# EAGLE design Test1 (EAGLE 7.6.0)
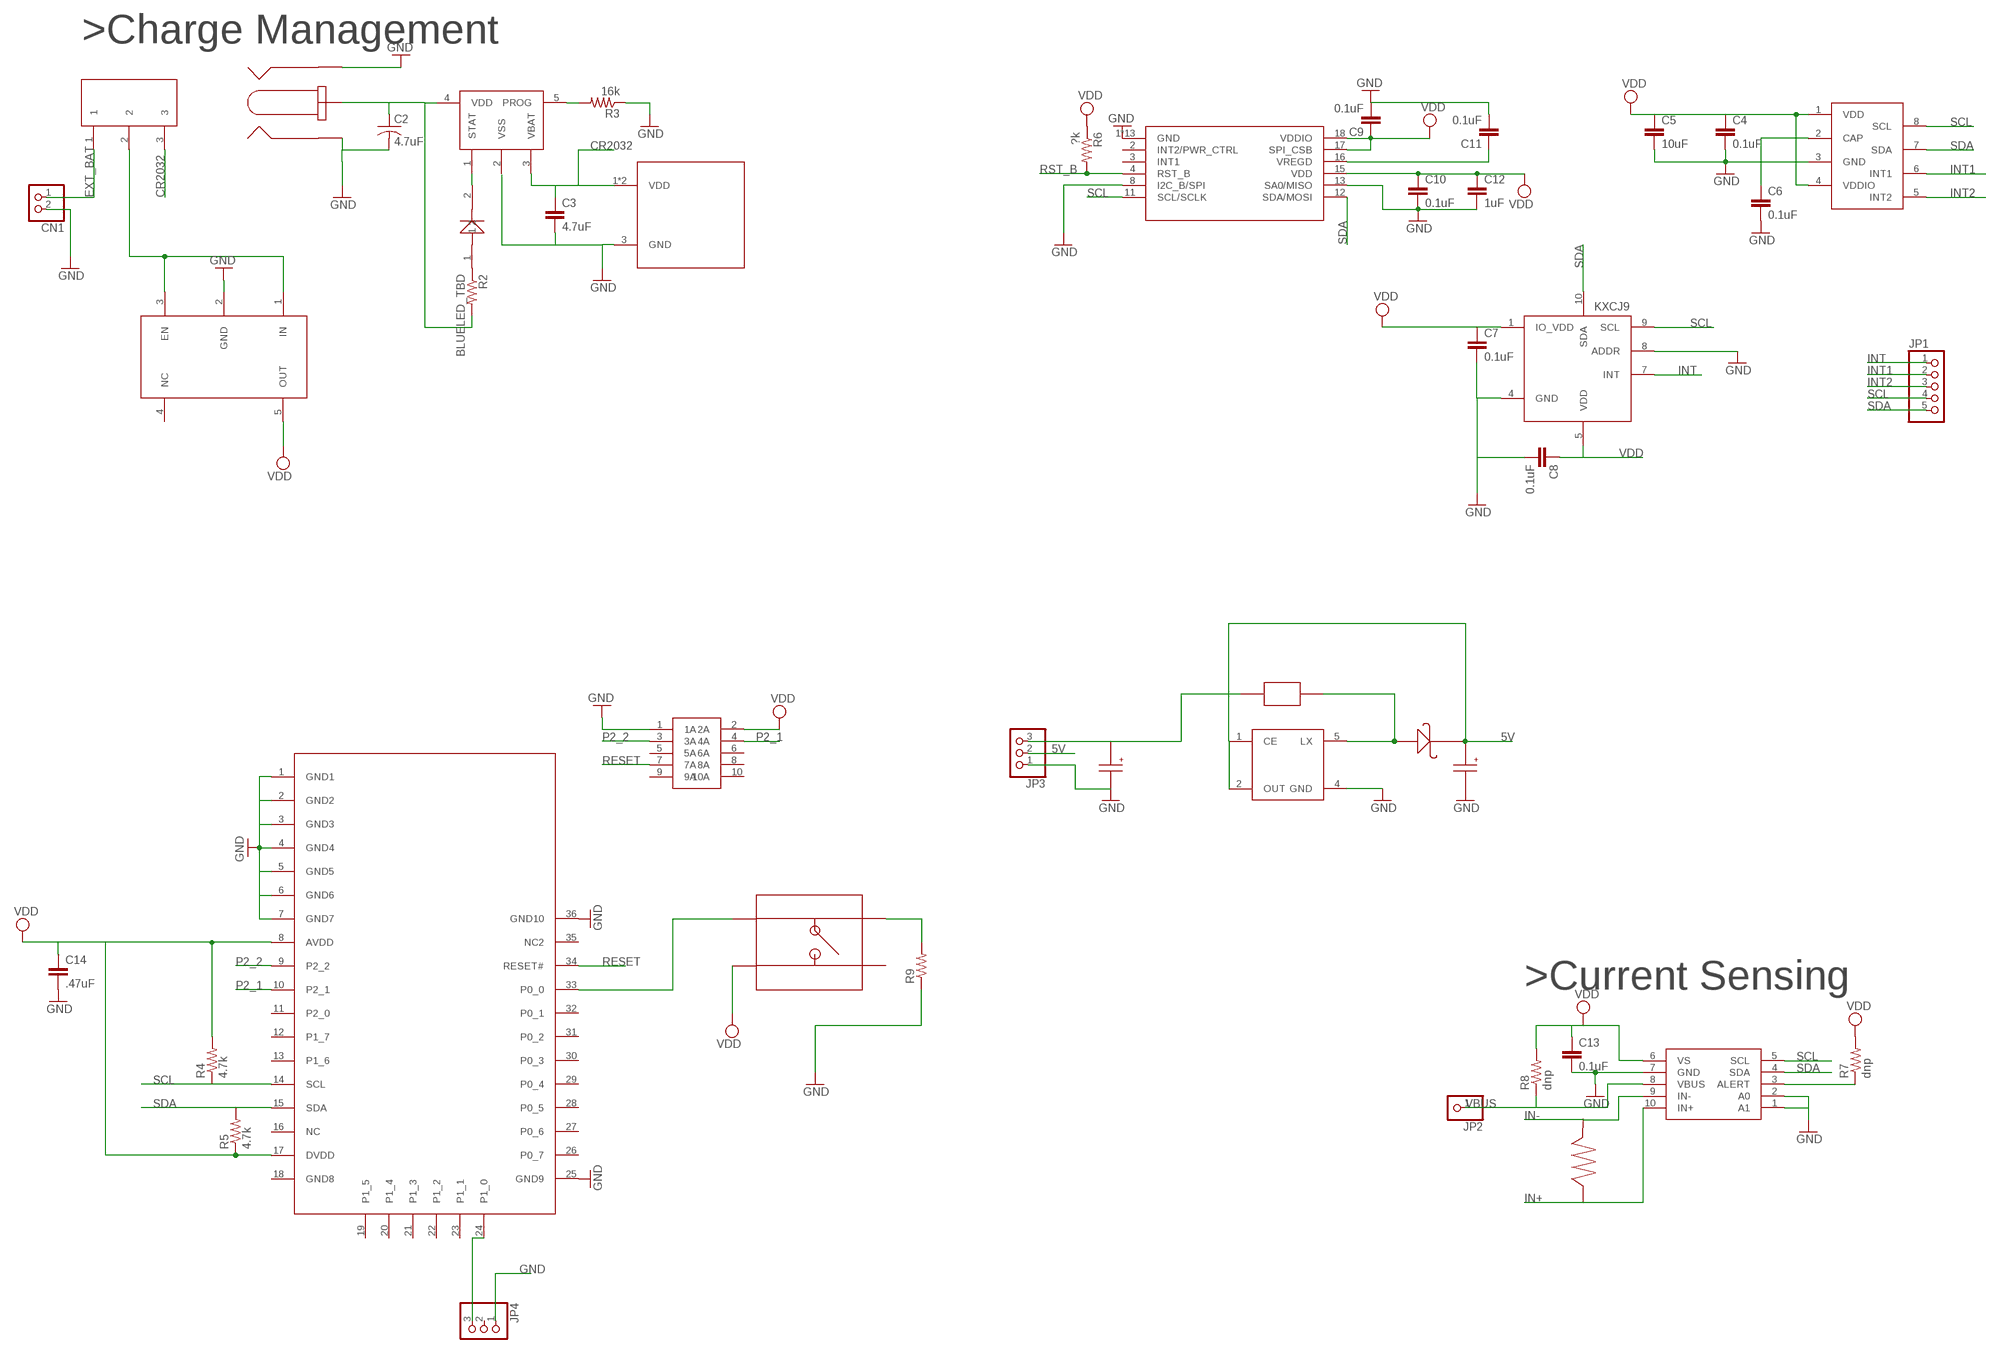
[diagram p0: schematic, sheet 1]

## Parts
C2  4.7uF  C-USC0603  [C0603]
C3  4.7uF  C-EUC0402  [C0402]
C4  0.1uF  C-EUC0402  [C0402]
C5  10uF  C-EUC0402  [C0402]
C6  0.1uF  C-EUC0402  [C0402]
C7  0.1uF  C-EUC0402  [C0402]
C8  0.1uF  C-EUC0402  [C0402]
C9  0.1uF  C-EUC0402  [C0402]
C10  0.1uF  C-EUC0402  [C0402]
C11  0.1uF  C-EUC0402  [C0402]
C12  1uF  C-EUC0402  [C0402]
C13  0.1uF  C-EUC0402  [C0402]
C14  .47uF  C-EUC0402  [C0402]
CN1  JST_2PIN-THM  [JST-PH-2-THM]
JP1  PINHD-1X5  [1X05]
JP2  PINHD-1X1  [1X01]
JP3  PINHD-1X3  [1X03]
JP4  PINHD-1X3/90  [1X03/90]
R2  BLUELED_TBD  R-US_R0402  [R0402]
R3  16k  R-US_R0402  [R0402]
R4  4.7k  R-US_R0402  [R0402]
R5  4.7k  R-US_R0402  [R0402]
R6  ?k  R-US_R0402  [R0402]
R7  dnp  R-US_R0402  [R0402]
R8  dnp  R-US_R0402  [R0402]
R9  R-US_R0402  [R0402]
U$1  BAT-HLD-001  [BAT-HLD-001]
U$2  INA226  [INA226]
U$3  FXAS21002  [FXAS21002]
U$4  PJ-040  [PJ-040]
U$5  PTS840  [PTS840]
U$6  CD54NP-470LC  [CD54NP-470LC]
U$7  MRB0520LT1G  [SOD-323F]
U$8  MIC5203  [SOT23-5L]
U$9  MLP3115A2  [MLP3115A2]
U$10  RIBBON_10POS_MALE  [RIBBON_10POS_MALE]
U$11  BLE113  [BLUEGIGA]
U$12  SPDT_THRU  [SPDT_THRU]
U$13  KXCJ9  [KXCJ9]
U$14  LTST-C190KRKT  [LTST-C190KRKT]
U$15  ERJ-MS6SFM50U  [ERJ-MS6SFM50U]
U$16  MCP73831  [MCP73831]
U$17  NCP1402  [SOT23-5L]
U$18  10uF  C2413  [C2413]
U$19  68uF  C2413  [C2413]

## Nets
5V: JP3.2 U$7.2 U$17.1(CE) U$17.2(OUT) U$19.1
CR2032: C3.1 U$1.1(VDD) U$1.2(VDD) U$12.3 U$16.3(VBAT)
EXT_BAT: CN1.1 U$12.1
GND: C2.2 C3.2 C4.2 C5.2 C6.2 C7.2 C8.2 C9.2 C10.2 C11.2 C12.2 C13.2 C14.2 CN1.2 JP3.1 JP4.1 R3.1 R9.1 U$1.3(GND) U$2.1(A1) U$2.2(A0) U$2.7(GND) U$3.1(GND) U$3.5(GND) U$3.6(GND) U$3.7(GND) U$3.8(I2C_B/SPI) U$3.9(GND) U$3.10(GND) U$3.13(SA0/MISO) U$3.14(GND) U$3.19(GND) U$3.20(GND) U$3.21(GND) U$3.22(GND) U$3.23(GND) U$3.24(GND) U$4.2 U$4.3 U$8.2(GND) U$9.3(GND) U$10.1(1A) U$11.1(GND1) U$11.2(GND2) U$11.3(GND3) U$11.4(GND4) U$11.5(GND5) U$11.6(GND6) U$11.7(GND7) U$11.25(GND9) U$11.36(GND10) U$13.4(GND) U$13.8(ADDR) U$17.4(GND) U$18.2 U$19.2
IN+: U$2.10(IN+) U$15.1
IN-: U$2.9(IN-) U$15.2
INT: JP1.1 U$13.7(INT)
INT1: JP1.2 U$9.6(INT1)
INT2: JP1.3 U$9.5(INT2)
N$1: JP4.3 U$11.24(P1_0)
N$3: C2.1 R2.2 U$4.1 U$16.4(VDD)
N$4: U$14.2 U$16.1(STAT)
N$5: R2.1 U$14.1
N$6: R3.2 U$16.5(PROG)
N$7: C6.1 U$9.2(CAP)
N$9: C11.1 U$3.16(VREGD)
N$10: U$8.1(IN) U$8.3(EN) U$12.2
N$11: U$5.4 U$11.33(P0_0)
N$12: R9.2 U$5.3
N$13: R7.1 U$2.3(ALERT)
N$15: JP3.3 U$6.1 U$18.1
N$16: U$6.2 U$7.1 U$17.5(LX)
P2_1: U$10.4(4A) U$11.10(P2_1)
P2_2: U$10.3(3A) U$11.9(P2_2)
RESET: U$10.7(7A) U$11.34(RESET#)
RST_B: R6.2 U$3.4(RST_B)
SCL: JP1.4 R4.1 U$2.5(SCL) U$3.11(SCL/SCLK) U$9.8(SCL) U$11.14(SCL) U$13.9(SCL)
SDA: JP1.5 R5.2 U$2.4(SDA) U$3.12(SDA/MOSI) U$9.7(SDA) U$11.15(SDA) U$13.10(SDA)
VBUS: JP2.1 R8.1 U$2.8(VBUS)
VDD: C4.1 C5.1 C7.1 C8.1 C9.1 C10.1 C12.1 C13.1 C14.1 R4.2 R5.1 R6.1 R7.2 R8.2 U$2.6(VS) U$3.15(VDD) U$3.17(SPI_CSB) U$3.18(VDDIO) U$5.2 U$8.5(OUT) U$9.1(VDD) U$9.4(VDDIO) U$10.2(2A) U$11.8(AVDD) U$11.17(DVDD) U$13.1(IO_VDD) U$13.5(VDD)
Unconnected: JP4.2 U$3.2(INT2/PWR_CTRL) U$3.3(INT1) U$5.1 U$8.4(NC) U$10.5(5A) U$10.6(6A) U$10.8(8A) U$10.9(9A) U$10.10(10A) U$11.11(P2_0) U$11.12(P1_7) U$11.13(P1_6) U$11.16(NC) U$11.18(GND8) U$11.19(P1_5) U$11.20(P1_4) U$11.21(P1_3) U$11.22(P1_2) U$11.23(P1_1) U$11.26(P0_7) U$11.27(P0_6) U$11.28(P0_5) U$11.29(P0_4) U$11.30(P0_3) U$11.31(P0_2) U$11.32(P0_1) U$11.35(NC2) U$16.2(VSS)

## Notes on the sheet
- >Charge Management
- >Current Sensing

## Library data of the parts
C2 = resistor:C-US: CAPACITOR, American symbol
C3-C14 = rcl:C-EU: CAPACITOR, European symbol
CN1 = adafruit:JST_2PIN: JST 2-Pin Connectors of various flavors SMT-RA (S2B-PH-SM4) 4UConnector #17311 SMT (B2B-PH-SM4) THM-RA (S2B-PH) THM (B2B-PH)
JP1 = pinhead:PINHD-1X5: PIN HEADER
JP2 = pinhead:PINHD-1X1: PIN HEADER
JP3 JP4 = pinhead:PINHD-1X3: PIN HEADER
R2-R9 = resistor:R-US_: RESISTOR, American symbol
U$1 = Charles:BAT-HLD-001
U$2 = Charles:INA226: High-Side or Low-Side Measurement Bi-Directional Current and Power Monitor w/ I2C
U$3 = Charles:FXAS21002: 3-Axis Digital Angular Rate Gyroscope (I2C/SPI)
U$4 = Charles:PJ-040: DC Power Jack 24V 1A (CP-040PJCT-ND)
U$5 = Charles:PTS840: SMD Momentary Switch -12V 50mA -
U$6 = Charles:CD54NP-470LC: 47uH 720mA Unshielded Power Inductor
U$7 = Charles:MRB0520LT1G: SCHOTTKY BARRIER RECTIFIER 0.5 AMPERES, 20 VOLTS
U$8 = James:MIC5203
U$9 = Charles:MLP3115A2
U$10 = James:RIBBON_10POS_MALE
U$11 = James:BLE113
U$12 = James:SPDT_THRU
U$13 = Charles:KXCJ9: Tri-Axis Digital Accelerometer (2g, 4g, 8g selectable)
U$14 = Charles:LTST-C190KRKT: Lite-On Inc. SMD LED
U$15 = Charles:ERJ-MS6SFM50U: Shunt Resistor (R2526)
U$16 = Charles:MCP73831: Miniature Single-Cell, Fully Integrated Li-Ion/Li-Poly Charge Management Controller
U$17 = Charles:NCP1402: 150mA PFM Step-Up Micropower Switching Regulator
U$18 U$19 = Charles:C2413: Capacitor Package 2413 (6032 Metric)

## Board
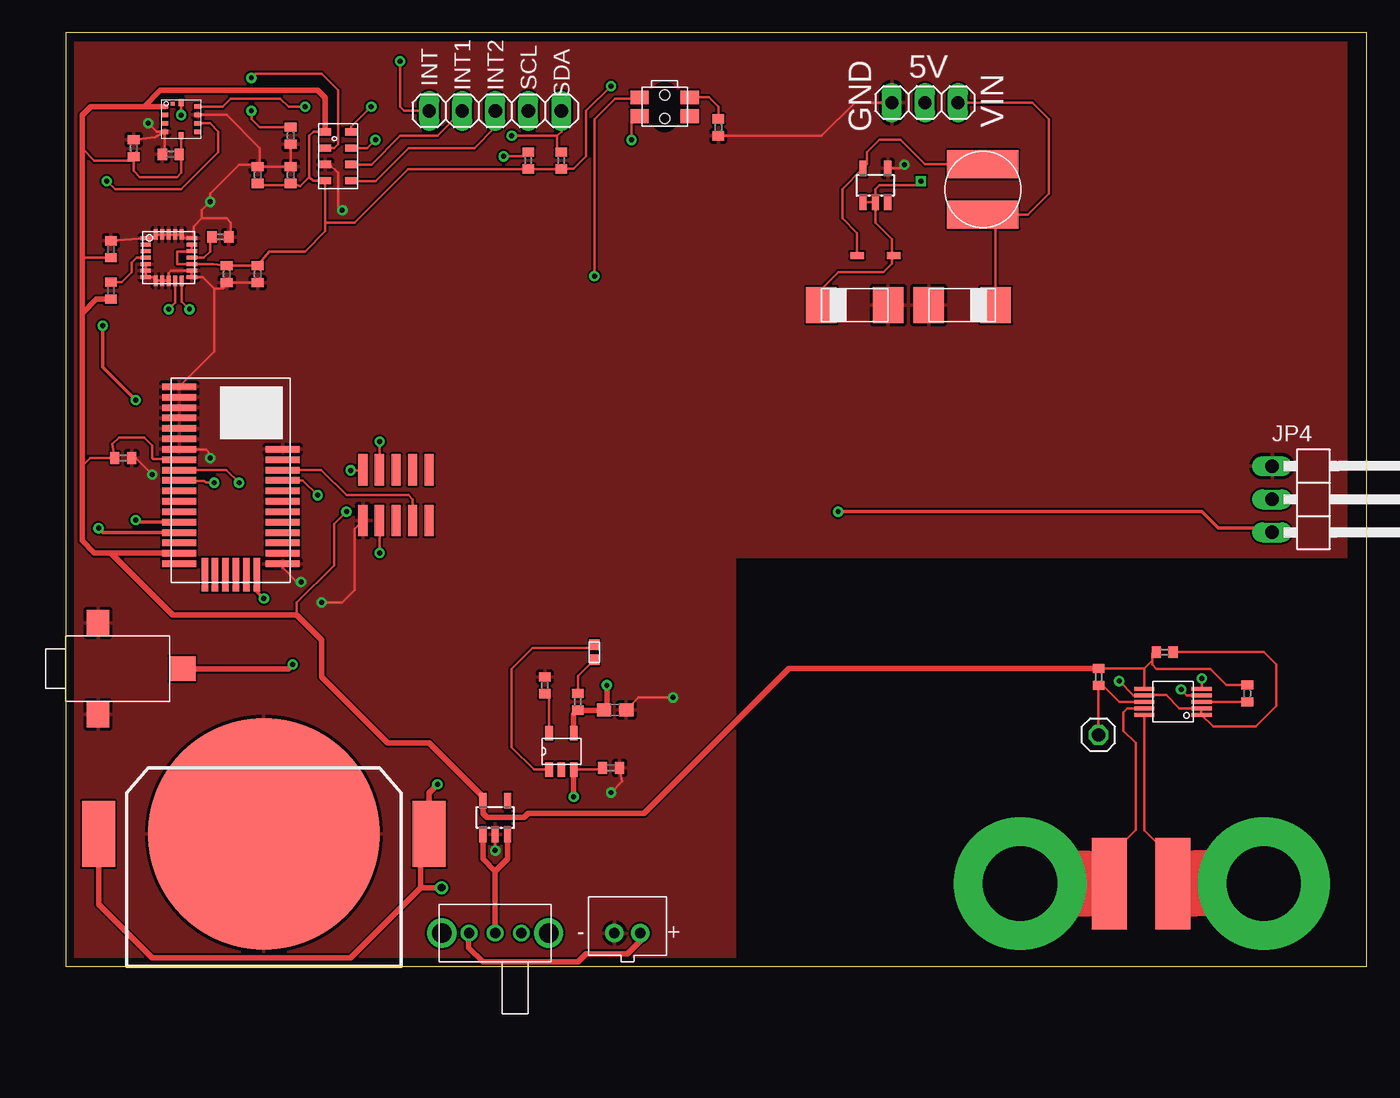
[diagram p1: board, top side]
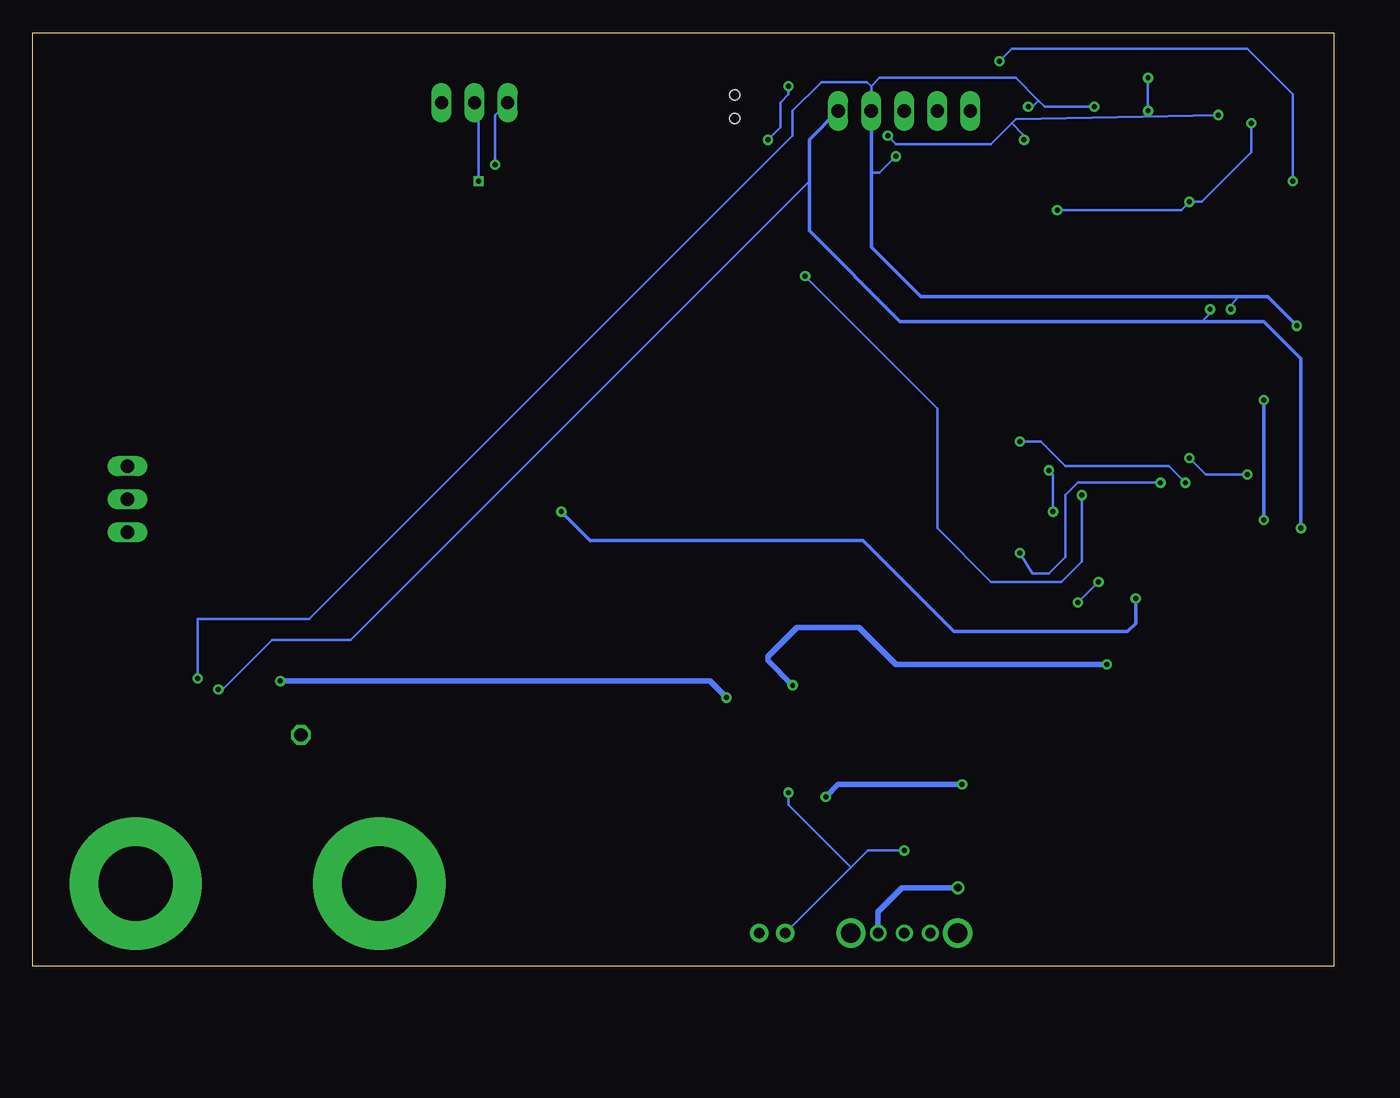
[diagram p2: board, bottom side, seen from below]

Size 100 x 71.75 mm. Coordinates in mm from the lower left corner, seen from the top.
Outline: 0,0 100,0 100,71.75 0,71.75 0,0
Copper layers (1*16): Top 0.035mm / dielectric 1.5mm / Bottom 0.035mm
Design rules "DRC_rules": minimum track width 8mil, minimum drill 15mil, track to track 6mil, track to pad 6mil, pad to pad 6mil, via to via 6mil, smd to smd 6mil, copper to edge 25mil, drill to drill 6mil, minimum pad ring 10mil, minimum via ring 8mil, stop-mask expansion 4mil, vias tented up to drill 0mil, thermal gap 10mil

### Footprints (pad centres in the part's own frame; a part is rotated, then mirrored left to right if it is on the bottom)
C0603 = smd 1.1 x 1: 1 -0.85,0; 2 0.85,0
C0402 = smd 0.7 x 0.9: 1 -0.65,0; 2 0.65,0
JST-PH-2-THM = drill 0.8 pad 1.422: 1 1,0; 2 -1,0
1X05 = drill 1.016 long: 1 -5.08,0; 2 -2.54,0; 3 0,0; 4 2.54,0; 5 5.08,0
1X01 = drill 1.016 octagon: 1 0,0
1X03 = drill 1.016 long: 1 -2.54,0; 2 0,0; 3 2.54,0
1X03/90 = drill 1.016 long: 1 -2.54,-3.81; 2 0,-3.81; 3 2.54,-3.81
R0402 = smd 0.7 x 0.9: 1 -0.65,0; 2 0.65,0
BAT-HLD-001 = smd 2.54 x 5.08: 1 -12.7,0; 2 12.7,0 | smd 17.78 x 17.78: 3 0,0
INA226 = smd 0.3 x 1.55: 1 -1,-2.2; 2 -0.5,-2.2; 3 0,-2.2; 4 0.5,-2.2; 5 1,-2.2; 6 1,2.2; 7 0.5,2.2; 8 0,2.2; 9 -0.5,2.2; 10 -1,2.2
FXAS21002 = smd 0.8 x 0.3: 1 -1.775,1.5; 2 -1.775,1; 3 -1.775,0.5; 4 -1.775,0; 5 -1.775,-0.5; 6 -1.775,-1; 7 -1.775,-1.5; 13 1.775,-1.5; 14 1.775,-1; 15 1.775,-0.5; 16 1.775,0; 17 1.775,0.5; 18 1.775,1; 19 1.775,1.5 | smd 0.3 x 0.8: 8 -1,-1.775; 9 -0.5,-1.775; 10 0,-1.775; 11 0.5,-1.775; 12 1,-1.775; 20 1,1.775; 21 0.5,1.775; 22 0,1.775; 23 -0.5,1.775; 24 -1,1.775
PJ-040 = smd 2 x 1.9: 1 9,0 | smd 1.7 x 2: 2 2.5,3.5; 3 2.5,-3.5
PTS840 = smd 1.4 x 1.05: 1 -1.925,0.725; 2 1.925,0.725; 3 -1.925,-0.725; 4 1.925,-0.725 | hole 0.8: 0,0.9; 0,-0.9
CD54NP-470LC = smd 5.5 x 2.15: 1 0,-1.925; 2 0,1.925
SOD-323F = smd 0.55 x 1.05: 1 0,1.4; 2 0,-1.4
SOT23-5L = smd 0.55 x 1.2: 1 -0.95,-1.3; 2 0,-1.3; 3 0.95,-1.3; 4 0.95,1.3; 5 -0.95,1.3
MLP3115A2 = smd 0.95 x 0.55: 1 -1,1.875; 2 -1,0.625; 3 -1,-0.625; 4 -1,-1.875; 5 1,-1.875; 6 1,-0.625; 7 1,0.625; 8 1,1.875
RIBBON_10POS_MALE = smd 0.72 x 2.4: 1 -5.08,-1.95; 2 -5.08,1.95; 3 -3.81,-1.95; 4 -3.81,1.95; 5 -2.54,-1.95; 6 -2.54,1.95; 7 -1.27,-1.95; 8 -1.27,1.95; 9 0,-1.95; 10 0,1.95
BLUEGIGA = smd 2.6 x 0.5: 1 -3.975,9.6; 2 -3.975,8.8; 3 -3.975,8; 4 -3.975,7.2; 5 -3.975,6.4; 6 -3.975,5.6; 7 -3.975,4.8; 8 -3.975,4; 9 -3.975,3.2; 10 -3.975,2.4; 11 -3.975,1.6; 12 -3.975,0.8; 13 -3.975,0; 14 -3.975,-0.8; 15 -3.975,-1.6; 16 -3.975,-2.4; 17 -3.975,-3.2; 18 -3.975,-4; 25 3.975,-4; 26 3.975,-3.2; 27 3.975,-2.4; 28 3.975,-1.6; 29 3.975,-0.8; 30 3.975,0; 31 3.975,0.8; 32 3.975,1.6; 33 3.975,2.4; 34 3.975,3.2; 35 3.975,4; 36 3.975,4.8 | smd 0.5 x 2.6: 19 -2,-4.85; 20 -1.2,-4.85; 21 -0.4,-4.85; 22 0.4,-4.85; 23 1.2,-4.85; 24 2,-4.85
SPDT_THRU = drill 0.787: 1 -2.007,0; 2 0,0; 3 2.007,0 | drill 1.499: A1 -4.102,0; A2 4.102,0
KXCJ9 = smd 0.55 x 0.35: 1 -1.275,0.975; 2 -1.275,0.325; 3 -1.275,-0.325; 4 -1.275,-0.975; 6 1.275,-0.975; 7 1.275,-0.325; 8 1.275,0.325; 9 1.275,0.975 | smd 0.35 x 0.55: 5 0,-1.275; 10 0,1.275 | smd 0.3 x 0.3: P$11 -0.65,1.2
LTST-C190KRKT = smd 0.787 x 0.787: 1 -0.572,0; 2 0.572,0
ERJ-MS6SFM50U = smd 2.7 x 7: 1 -2.54,0; 2 2.35,0
MCP73831 = smd 0.6 x 1.1: 1 -0.95,-1.4; 2 0,-1.4; 3 0.95,-1.4; 4 0.95,1.4; 5 -0.95,1.4
C2413 = smd 2.35 x 2.77: 1 -2.57,0; 2 2.57,0

### Placement (x,y rotation side)
C2  42.23,19.68 0 top
C3  41.91,15.24 0 top
C4  14.76,60.8 90 top
C5  17.3,60.8 90 top
C6  17.3,63.82 270 top
C7  5.24,62.87 90 top
C8  8.1,62.39 180 top
C9  12.38,53.18 270 top
C10  14.76,53.18 270 top
C11  11.91,56.04 0 top
C12  3.49,55.09 90 top
C13  84.45,24.13 0 top
C14  4.45,39.05 0 top
CN1  43.18,2.54 0 top
JP1  33.02,65.72 0 top
JP2  79.38,17.78 180 top
JP3  66.04,66.36 0 top
JP4  96.52,35.88 270 top
R2  39.37,20.32 270 top
R3  36.83,21.59 270 top
R4  35.56,61.91 270 top
R5  38.1,61.91 90 top
R6  3.49,51.91 90 top
R7  90.81,20.95 90 top
R8  79.38,22.23 90 top
R9  50.16,64.45 90 top
U$1  15.24,10.16 0 top
U$2  85.09,20.32 90 top
U$3  7.94,54.45 0 top
U$4  0,22.86 0 top
U$5  46.04,66.04 180 top
U$6  70.48,59.69 0 top
U$7  62.23,54.61 90 top
U$8  33.02,11.43 0 top
U$9  20.95,62.23 0 top
U$10  27.94,36.2 0 top
U$11  12.7,34.92 0 top
U$12  33.02,2.54 0 top
U$13  8.89,65.09 0 top
U$14  40.64,24.13 90 top
U$15  82.55,6.35 180 top
U$16  38.1,16.51 0 top
U$17  62.23,60.01 0 top
U$18  68.9,50.8 180 top
U$19  60.64,50.8 0 top

### Tracks (layer width: path | path; a pad name or v marks a point on that pad's centre or on a via)
5V  (via drill 0.38)
  Top 0.203: U$19.1 58.07,52.04 59.37,53.34 62.87,53.34 63.5,53.98 63.5,54.48 U$7.2 63.5,54.74 63.5,55.88 62.23,57.15 U$17.2 | U$17.2 U$17.1 | U$17.2 62.23,59.69 62.55,60.01 65.41,60.01 v65.72,60.33
  Bottom 0.203: v65.72,60.33 65.72,66.04 JP3.2
CR2032  (via drill 0.38 pad 0.74, 0.6)
  Top 0.203: U$16.3 40.93,15.11 C3.1
  Top 0.406: U$1.1 2.54,4.76 6.67,0.64 21.91,0.64 27.3,6.03 | 27.3,6.03 27.3,9.53 U$1.2 27.94,13.34 v28.57,13.97 | v28.89,6.03 27.3,6.03 | v39.05,13.02 U$16.3
  Bottom 0.406: v28.57,13.97 38.1,13.97 v39.05,13.02 | v28.89,6.03 33.19,6.03 35.05,4.17 35.05,2.56 U$12.3
EXT_BAT
  Top 0.406: CN1.1 44.18,1.95 43.18,0.95 40.01,0.95 39.37,0.32 32.07,0.32 30.96,1.43 30.96,2.48 U$12.1
GND  (via drill 0.38, 0.38 pad 0.74)
  Top 0.203: 85.41,24.13 C13.2 92.08,24.13 93.03,23.18 93.03,20 91.44,18.41 88.19,18.41 U$2.1 U$2.2 85.59,19.82 84.58,20.83 U$2.7 82.05,20.82 v80.96,21.91 | U$8.2 v33.02,8.89 | U$13.4 7.62,62.76 C8.2 | C7.2 6.9,63.72 U$13.4 | C5.2 C6.2 | C4.2 C5.2 | v46.67,20.64 44.03,20.64 C2.2 | C5.2 17.2,61.65 17.14,61.59 | U$13.8 12.38,65.41 14.92,62.87 14.92,61.81 C4.2 | U$11.25 16.68,30.63 17.78,29.53 v18.1,29.53 | v19.68,27.94 21.27,27.94 22.23,28.89 22.23,33.61 U$10.1 | C14.2 5.4,39.05 v6.67,37.78 | v11.11,39.05 11.11,39.37 10.79,39.69 8.76,39.69 U$11.7 | U$3.5 U$3.6 U$3.7 6.66,52.95 U$3.8 U$3.9 U$3.10 7.94,53.25 8.13,53.44 U$3.14 U$3.13 10.55,52.95 11.43,52.07 | C12.2 6.15,55.94 U$3.1 6.66,55.95 U$3.24 U$3.23 U$3.22 U$3.21 U$3.20 9.21,55.95 U$3.19 9.77,55.95 9.84,55.88 9.84,56.83 10.48,57.47 | 10.48,57.47 12.38,57.47 12.7,57.15 12.7,56.09 C11.2 | 11.43,52.07 12.12,52.07 C9.2 C10.2 | 11.43,52.07 11.43,47.23 U$11.1 | U$13.4 7.01,64.11 v6.35,64.77 | C4.2 14.71,61.59 13.34,61.59 11.11,59.37 v11.11,58.74 10.48,58.1 10.48,57.47 | U$9.3 20.31,61.6 20.95,60.96 20.95,58.42 v21.27,58.1 | C3.2 42.76,14.19 v41.91,13.34 | R9.1 58.09,63.8 60.64,66.36 JP3.1 | U$17.4 64.17,61.31 v64.45,61.59
  Bottom 0.203: v33.02,8.89 35.83,8.89 37.12,7.6 | 37.12,7.6 CN1.2 | v18.1,29.53 v19.68,27.94 | v6.67,37.78 9.84,37.78 v11.11,39.05 | v6.35,64.77 6.35,62.55 10.16,58.74 v11.11,58.74 11.75,58.1 v21.27,58.1 | v41.91,13.34 41.91,12.38 37.12,7.6 | v64.45,61.59 64.45,65.41 JP3.1
  Bottom 0.406: v80.96,21.91 47.94,21.91 v46.67,20.64
  pour Top (isolate 0.127): 0.32,0.32 0.32,71.12 98.42,71.12 98.42,31.43 51.44,31.43 51.44,0.32
IN+  (via drill 5.71 pad 10.16)
  Top 0.203: U$2.10 82.89,10.46 83.82,9.53 83.82,7.62 U$15.1 86.68,6.35
  Top 5.08: v92.08,6.35 86.68,6.35
IN-
  Top 0.203: U$15.2 80.2,8.45 81.28,9.53 | 81.28,9.53 82.23,10.48 82.23,17.14 81.28,18.1 81.28,19.51 81.58,19.81 U$2.9 | 78.42,6.35 81.28,9.21 81.28,9.53
  Top 5.08: 73.66,6.35 78.42,6.35
INT  (via drill 0.38 pad 0.74)
  Top 0.203: U$13.7 11.12,64.76 11.75,64.14 11.75,62.55 8.89,59.69 3.81,59.69 v3.17,60.33 | v25.72,69.53 25.72,66.04 26.04,65.72 JP1.1
  Bottom 0.203: v3.17,60.33 3.17,66.99 6.67,70.48 24.77,70.48 v25.72,69.53
INT1
  Top 0.203: U$9.6 23.5,61.6 25.72,63.82 28.57,63.82 JP1.2
INT2
  Top 0.203: JP1.3 33.02,64.45 31.43,62.87 26.35,62.87 23.81,60.33 21.98,60.33 U$9.5
N$1  (via drill 0.38)
  Top 0.254: U$11.24 14.7,28.8 v15.24,28.26 | v59.37,34.92 87.31,34.92 88.58,33.66 92.39,33.66 JP4.3
  Bottom 0.254: v15.24,28.26 15.24,26.35 15.88,25.72 29.21,25.72 36.2,32.7 57.15,32.7 v59.37,34.92
N$2  (via drill 5.71 pad 10.16)
  other vias: 73.34,6.35
N$3  (via drill 0.38 pad 0.74)
  Top 0.203: C2.1 41.27,19.68
  Top 0.406: U$4.1 17.14,22.86 v17.46,23.18 | v41.59,21.59 41.59,19.9 C2.1 41.36,19.67 R2.2 39.05,19.35 U$16.4
  Bottom 0.406: v17.46,23.18 33.66,23.18 36.51,26.04 41.27,26.04 43.5,23.81 43.5,23.5 v41.59,21.59
N$4
  Top 0.203: U$16.1 36.01,15.11 34.29,16.83 34.29,22.86 35.88,24.45 40.39,24.45 U$14.2
N$5
  Top 0.203: R2.1 39.37,22.29 U$14.1
N$6
  Top 0.203: U$16.5 37.15,20.62 R3.2
N$7  (via drill 0.38 pad 0.74)
  Top 0.203: U$9.2 20.63,62.85 20.95,63.18 20.95,67.31 19.68,68.58 14.61,68.58 v14.29,68.26 | v14.29,65.72 14.29,65.09 14.92,64.45 17.09,64.45 C6.1
  Bottom 0.203: v14.29,68.26 v14.29,65.72
N$9
  Top 0.203: U$3.16 10.64,54.45 11.11,54.93 11.11,55.98 C11.1
N$10
  Top 0.406: U$12.2 33.02,7.3 | 33.02,7.3 33.97,8.26 U$8.3 | U$8.1 32.07,8.25 33.02,7.3
N$11  (via drill 0.38 pad 0.74)
  Top 0.203: U$11.33 18.24,37.33 v19.37,36.2 | v40.64,53.02 40.64,65.09 42.23,66.67 44.02,66.67 U$5.4
  Bottom 0.203: v19.37,36.2 19.37,31.11 20.95,29.53 26.35,29.53 30.48,33.66 30.48,42.86 v40.64,53.02
N$12
  Top 0.203: 49.95,65.31 R9.2 50.16,66.04 49.44,66.77 U$5.3
N$13
  Top 0.203: U$2.3 90.79,20.32 R7.1
N$15
  Top 0.203: U$18.1 71.47,56.78 U$6.1 73.96,57.77 75.56,59.37 75.56,65.09 74.3,66.36 JP3.3
N$16
  Top 0.203: U$7.1 60.83,56.33 59.69,57.47 59.69,59.72 U$17.5 61.59,61.62 61.59,62.55 62.55,63.5 64.14,63.5 66.02,61.62 U$6.2
P2_1  (via drill 0.38 pad 0.74)
  Top 0.203: U$10.4 v24.13,40.32 | v11.43,37.15 10.81,37.15 10.67,37.29 8.76,37.29 U$11.10
  Bottom 0.203: v24.13,40.32 22.54,40.32 20.64,38.42 12.7,38.42 v11.43,37.15
P2_2  (via drill 0.38 pad 0.74)
  Top 0.203: U$11.9 12.36,38.12 v13.34,37.15 | v24.13,31.75 U$10.3
  Bottom 0.203: v13.34,37.15 19.68,37.15 20.64,36.2 20.64,31.43 21.91,30.16 23.18,30.16 v24.13,31.75
RESET
  Top 0.203: U$11.34 19.66,38.12 21.59,36.2 26.35,36.2 26.67,35.88 U$10.7
RST_B
  Top 0.203: R6.2 4.3,52.56 5.08,53.34 5.08,54.05 5.49,54.46 U$3.4
SCL  (via drill 0.38, 0.38 pad 0.74)
  Top 0.203: U$2.5 87.29,21.3 87.31,21.27 v87.31,22.11 | U$3.11 8.44,50.98 v7.94,50.48 | 18.39,66.06 v18.41,66.04 17.14,66.04 16.51,66.67 12.7,66.67 12.09,66.06 U$13.9 | U$9.8 21.95,64.5 v23.5,66.04 | R4.1 35.23,62.23 v33.66,62.23
  Top 0.254: v2.86,49.21 2.86,46.04 v5.4,43.5 | v5.4,34.29 5.54,34.29 5.69,34.14 8.71,34.14 U$11.14
  Bottom 0.203: v7.94,50.48 7.94,50.8 7.3,51.44 | v18.41,66.04 22.23,66.04 22.7,66.52 | 22.7,66.52 24.45,68.26 34.92,68.26 35.56,67.63 | 35.56,67.63 JP1.4 | v23.5,66.04 23.18,66.04 22.7,66.52 | v87.31,22.11 87.31,26.67 78.74,26.67 41.59,63.82 41.59,65.72 39.37,67.94 35.88,67.94 35.56,67.63 | v33.66,62.23 34.92,60.96 35.56,60.96
  Bottom 0.254: JP1.4 35.56,60.96 35.56,55.24 31.75,51.44 7.3,51.44 5.08,51.44 v2.86,49.21 | v5.4,43.5 v5.4,34.29
SDA  (via drill 0.38 pad 0.74)
  Top 0.203: U$3.12 8.94,51.07 v9.53,50.48 | U$13.10 v8.89,65.41 | v34.29,63.82 37.78,63.82 | 37.78,63.82 38.1,64.14 JP1.5 | U$9.7 23.17,62.85 v23.81,63.5 | U$2.4 86.18,20.82 v85.72,21.27 | 37.78,63.82 37.78,62.88 R5.2
  Top 0.254: U$11.15 2.87,33.33 v2.54,33.66
  Bottom 0.203: v9.53,50.48 9.53,50.16 10.16,49.53 | v8.89,65.41 24.45,65.09 24.77,64.77 | 24.77,64.77 26.35,63.18 33.66,63.18 v34.29,63.82 | v23.81,63.5 23.81,63.82 24.77,64.77 | v85.72,21.27 85.41,21.27 81.6,25.08 75.56,25.08 40.32,60.33
  Bottom 0.254: v2.54,33.66 2.54,46.67 5.4,49.53 10.16,49.53 33.34,49.53 40.32,56.52 40.32,60.33 40.32,63.5 JP1.5
VBUS
  Top 0.203: U$2.8 80.96,20.32 79.71,21.57 R8.1 JP2.1
VDD  (via drill 0.38, 0.38 pad 0.74)
  Top 0.203: R7.2 89.2,21.61 87.95,22.86 83.82,22.86 83.5,23.18 83.5,23.5 | 83.5,23.5 83.5,24.03 C13.1 | U$2.6 82.89,22.88 | 82.89,22.88 83.5,23.5 | R8.2 82.88,22.88 82.89,22.88 | 17.78,26.99 17.78,27.94 20.64,30.8 20.64,33.97 v21.59,34.92 | v21.91,38.1 22.82,38.1 U$10.2 | 1.27,32.7 1.27,38.42 1.91,39.05 C14.1 3.6,40.11 4.13,40.64 6.03,40.64 6.67,40.01 6.67,39.05 6.76,38.96 8.69,38.96 U$11.8 | U$13.5 8.89,62.45 C8.1 8.89,62.33 8.89,60.96 8.57,60.64 5.71,60.64 5.24,61.12 C7.1 5.14,61.91 2.22,61.91 1.27,62.87 1.27,65.41 | U$13.1 1.93,66.06 | 18.73,60.64 19.02,60.35 U$9.4 19.95,57.15 | 18.73,60.64 18.73,63.82 19.05,64.14 19.93,64.14 U$9.1 | 18.73,60.64 18.04,59.95 C5.1 17.25,60.01 15.24,60.01 15.18,59.95 C4.1 | U$3.18 U$3.17 9.69,54.93 8.57,54.93 8.57,53.98 8.6,53.95 U$3.15 11.35,53.95 C9.1 C10.1 15.66,54.93 18.41,54.93 19.95,56.47 19.95,57.15 | 19.95,57.15 22.23,57.15 26.34,61.26 R4.2 R5.1 38.12,61.28 39.05,61.28 40.01,62.23 40.01,65.72 v41.91,67.63 | 1.27,54.29 1.33,54.24 1.53,54.44 C12.1 | v43.5,63.5 43.5,64.7 U$5.2
  Top 0.406: R8.2 55.58,22.88 44.45,11.75 35.56,11.75 35.24,11.43 32.38,11.43 32.07,11.75 U$8.5 32.07,13.02 27.94,17.14 24.77,17.14 19.68,22.23 19.68,25.08 17.78,26.99 8.26,26.99 3.49,31.75 | 3.49,31.75 8.7,31.75 U$11.17 | R6.1 2.37,51.26 1.27,50.16 | 1.27,50.16 1.27,32.7 2.22,31.75 3.49,31.75 | U$13.1 6.03,66.06 | 6.03,66.06 1.93,66.06 1.27,65.41 1.27,54.29 1.27,50.16 | U$9.1 19.95,66.72 19.37,67.31 7.28,67.31 6.03,66.06
  Bottom 0.203: v21.59,34.92 21.59,37.78 v21.91,38.1 | v41.91,67.63 41.91,66.99 42.55,66.36 42.55,64.45 v43.5,63.5

### Text on the board
tNames: SDA | INT | 5V | INT1 | INT2 | SCL | GND | VIN